# Altium schematic sheet Э3-12.SchDoc
size 594 x 420 mm; Address1: Address1; Address2: Address2; Address3: Address3; Address4: Address4; SheetNumber: 12; SheetTotal: 12; DocumentType: Схема электрическая принципиальная
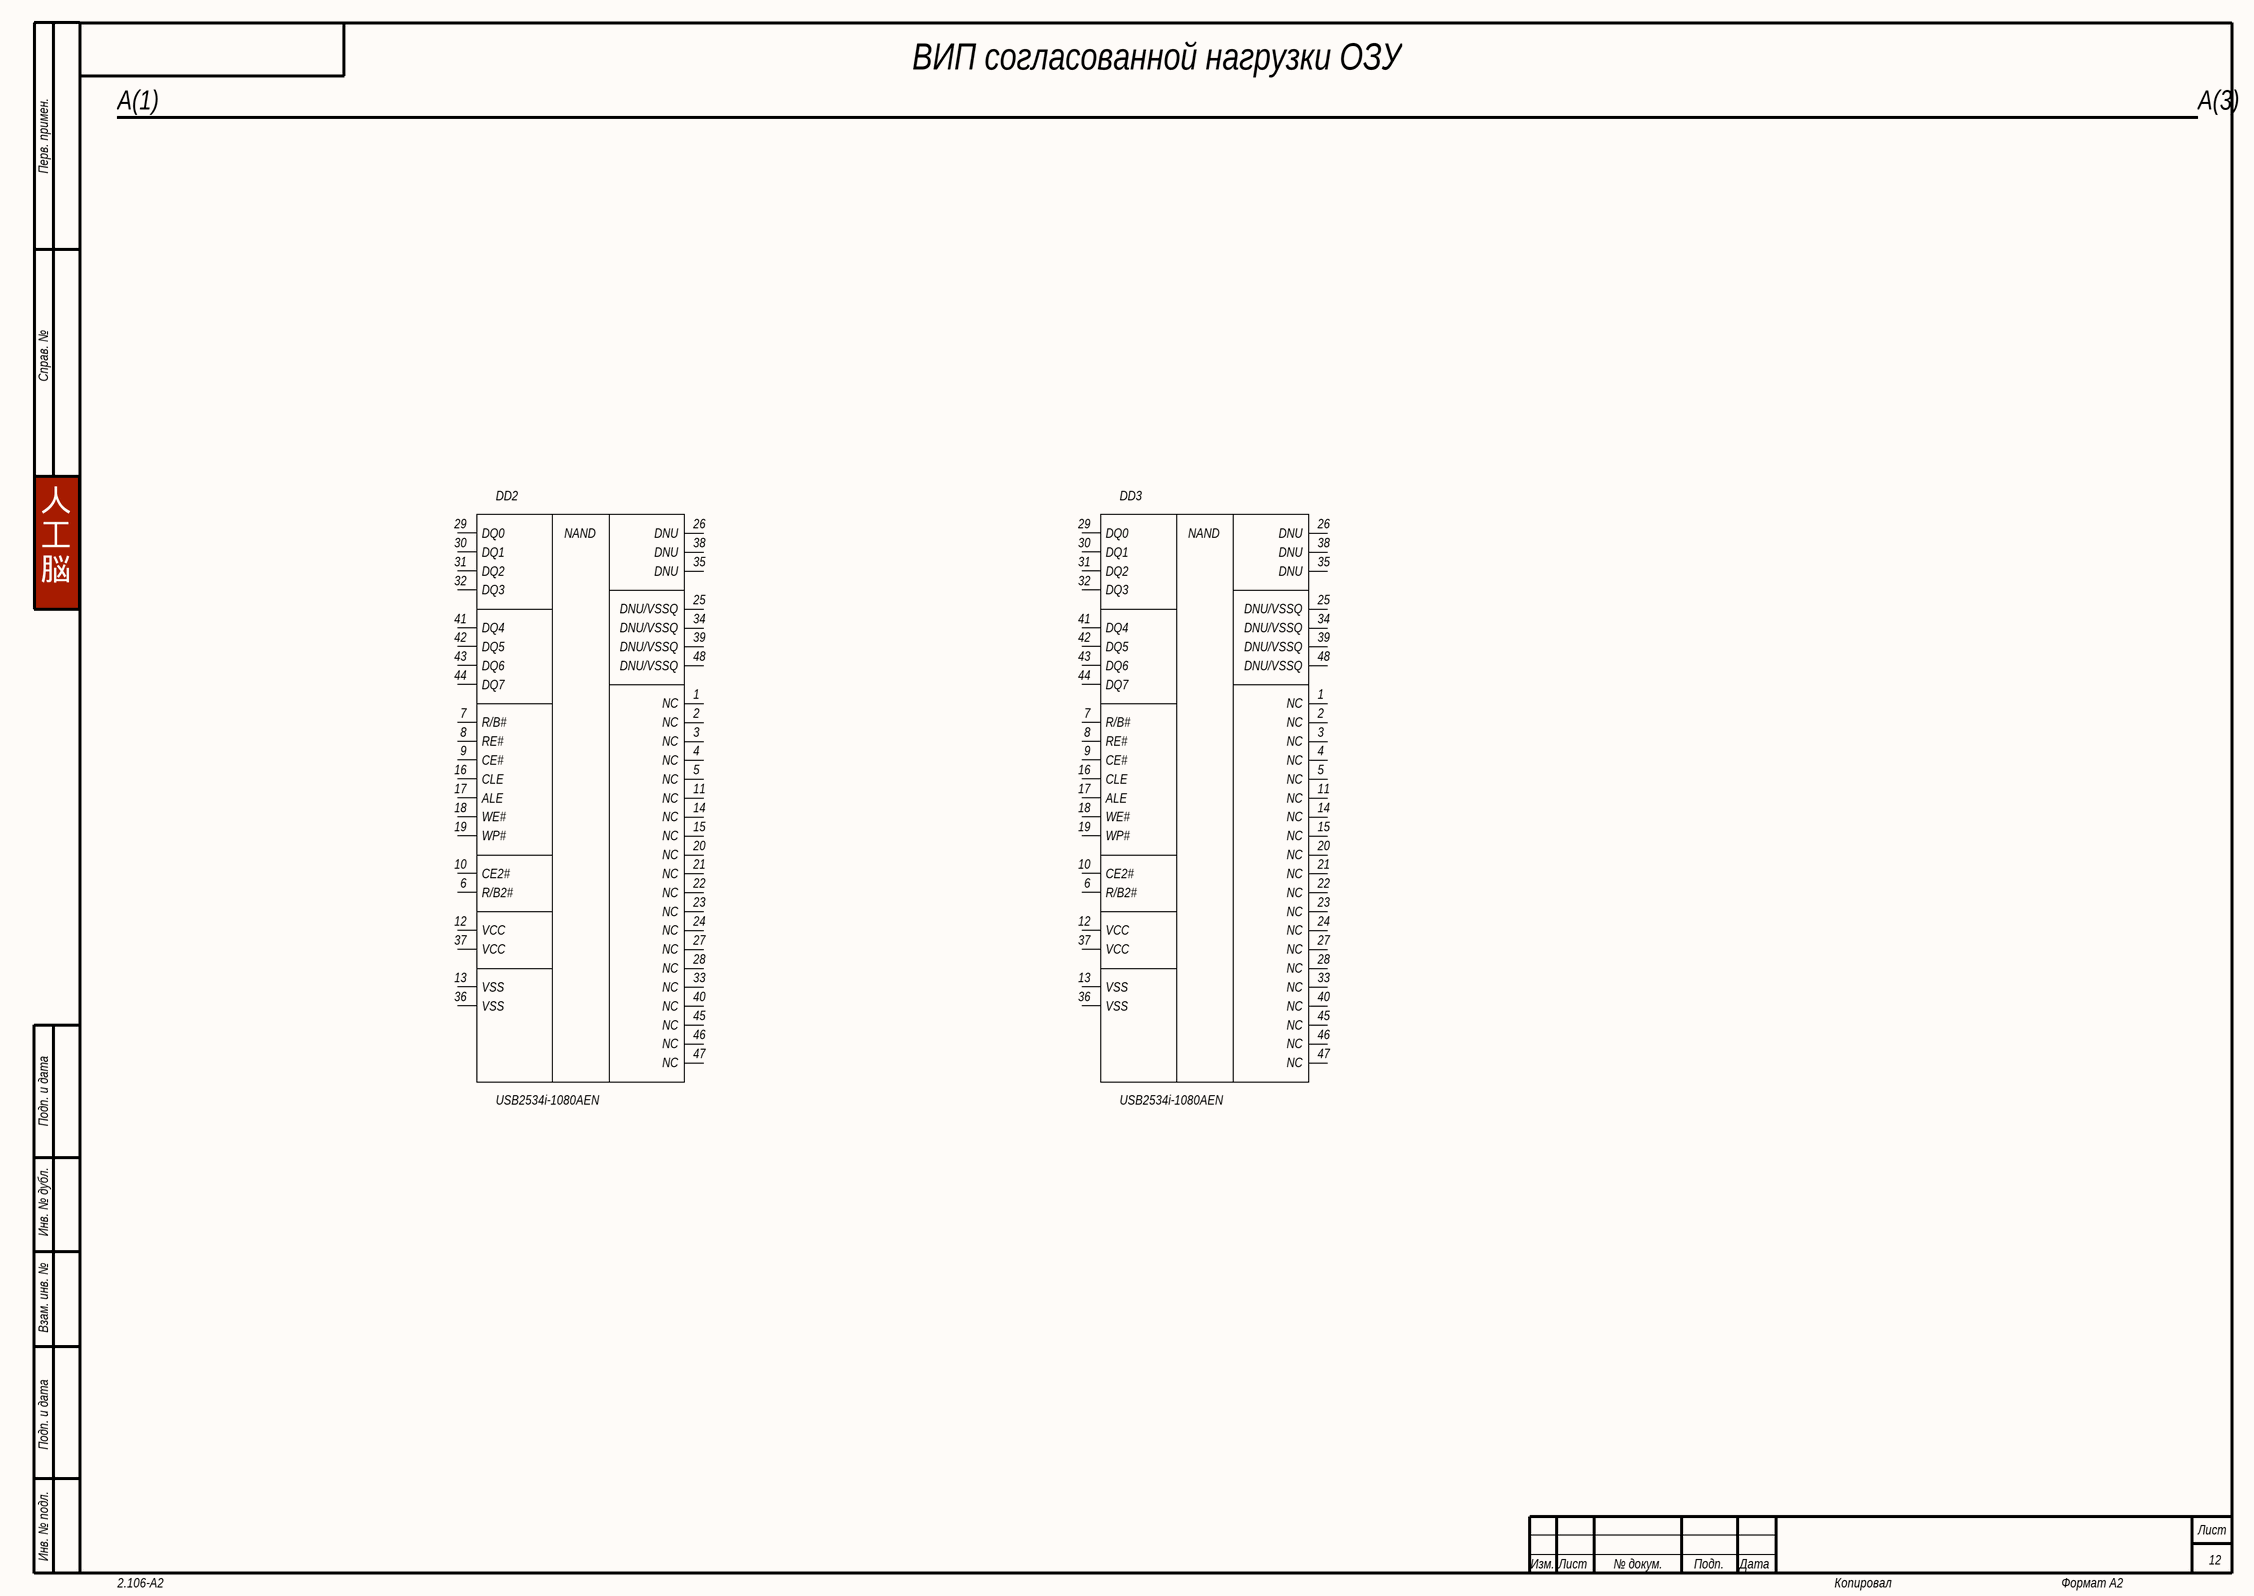
[diagram p0: Э3-12.SchDoc]

## Parts
DD2  USB2534i-1080AEN  [48-TSOP-1]
DD3  USB2534i-1080AEN  [48-TSOP-1]

## Nets

Not connected (* = marked no-connect by the designer): DD2 1(NC) 2(NC) 3(NC) 4(NC) 5(NC) 6(R/B2#) 7(R/B#) 8(RE#) 9(CE#) 10(CE2#) 11(NC) 12(VCC) 13(VSS) 14(NC) 15(NC) 16(CLE) 17(ALE) 18(WE#) 19(WP#) 20(NC) 21(NC) 22(NC) 23(NC) 24(NC) 25(DNU/VSSQ) 26(DNU) 27(NC) 28(NC) 29(DQ0) 30(DQ1) 31(DQ2) 32(DQ3) 33(NC) 34(DNU/VSSQ) 35(DNU) 36(VSS) 37(VCC) 38(DNU) 39(DNU/VSSQ) 40(NC) 41(DQ4) 42(DQ5) 43(DQ6) 44(DQ7) 45(NC) 46(NC) 47(NC) 48(DNU/VSSQ); DD3 1(NC) 2(NC) 3(NC) 4(NC) 5(NC) 6(R/B2#) 7(R/B#) 8(RE#) 9(CE#) 10(CE2#) 11(NC) 12(VCC) 13(VSS) 14(NC) 15(NC) 16(CLE) 17(ALE) 18(WE#) 19(WP#) 20(NC) 21(NC) 22(NC) 23(NC) 24(NC) 25(DNU/VSSQ) 26(DNU) 27(NC) 28(NC) 29(DQ0) 30(DQ1) 31(DQ2) 32(DQ3) 33(NC) 34(DNU/VSSQ) 35(DNU) 36(VSS) 37(VCC) 38(DNU) 39(DNU/VSSQ) 40(NC) 41(DQ4) 42(DQ5) 43(DQ6) 44(DQ7) 45(NC) 46(NC) 47(NC) 48(DNU/VSSQ)

## Notes on the sheet
- A(1)
- ВИП согласованной нагрузки ОЗУ
- A(3)
- 人
  工
  脳
- Перв. примен.
- Справ. №
- Подп. и дата
- Инв. № дубл.
- Взам. инв. №
- Инв. № подл.
- Изм.
- Лист
- № докум.
- Подп.
- Дата
- 2.106-A2
- Копировал
- Формат А2
- (in symbol MT29F32G08ABAAAWP-ITZ:A) NAND

## Library data of the parts
DD2 DD3 = MT29F32G08ABAAAWP-ITZ:A: SLC NAND Flash 32 Гб; Manufacturer: Micron Technology, Inc.; TemperatureRange: -40...+85°C; Package: 48-TSOP; DatasheetURL: *; HelpURL: *; PinCount: 48; PartNumber: USB2534i-1080AEN; ComponentType: IC